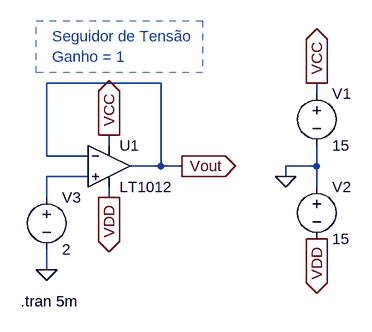
[diagram p0: schematic OpAmp_BUFFER.asc]
OpAmp_BUFFER.asc, the LTspice schematic file:
Version 4
SHEET 1 880 680
WIRE 320 16 144 16
WIRE 560 32 560 16
WIRE 240 112 240 96
WIRE 144 128 144 16
WIRE 208 128 144 128
WIRE 320 144 320 16
WIRE 320 144 272 144
WIRE 352 144 320 144
WIRE 560 144 560 112
WIRE 560 144 512 144
WIRE 208 160 144 160
WIRE 512 160 512 144
WIRE 560 176 560 144
WIRE 144 192 144 160
WIRE 240 192 240 176
WIRE 144 304 144 272
FLAG 512 160 0
FLAG 560 16 VCC
IOPIN 560 16 Out
FLAG 560 256 VDD
IOPIN 560 256 Out
FLAG 240 96 VCC
IOPIN 240 96 Out
FLAG 240 192 VDD
IOPIN 240 192 Out
FLAG 352 144 Vout
IOPIN 352 144 Out
FLAG 144 304 0
SYMBOL Opamps\\LT1012 240 80 R0
SYMATTR InstName U1
SYMBOL voltage 560 16 R0
SYMATTR InstName V1
SYMATTR Value 15
SYMBOL voltage 560 160 R0
SYMATTR InstName V2
SYMATTR Value 15
SYMBOL voltage 144 176 R0
SYMATTR InstName V3
SYMATTR Value 2
TEXT 104 352 Left 2 !.tran 5m
TEXT 152 -56 Left 2 ;Seguidor de Tensão\nGanho = 1
RECTANGLE Normal 384 0 128 -80 2

The netlist it stands for:
* OpAmp_BUFFER.asc
XU1 N001 Vout VCC VDD Vout LT1012  ; pins In+ In- V+ V- OUT
V1 VCC 0 15
V2 0 VDD 15
V3 N001 0 2
.tran 5m
* Seguidor de Tensão
* Ganho = 1
.backanno
.end